# EAGLE design Adafruit SIM808 Breakout (EAGLE 6.6.0)
COMPANY: ADAFRUIT INDUSTRIES; DRAWN: KTOWN; REV: C
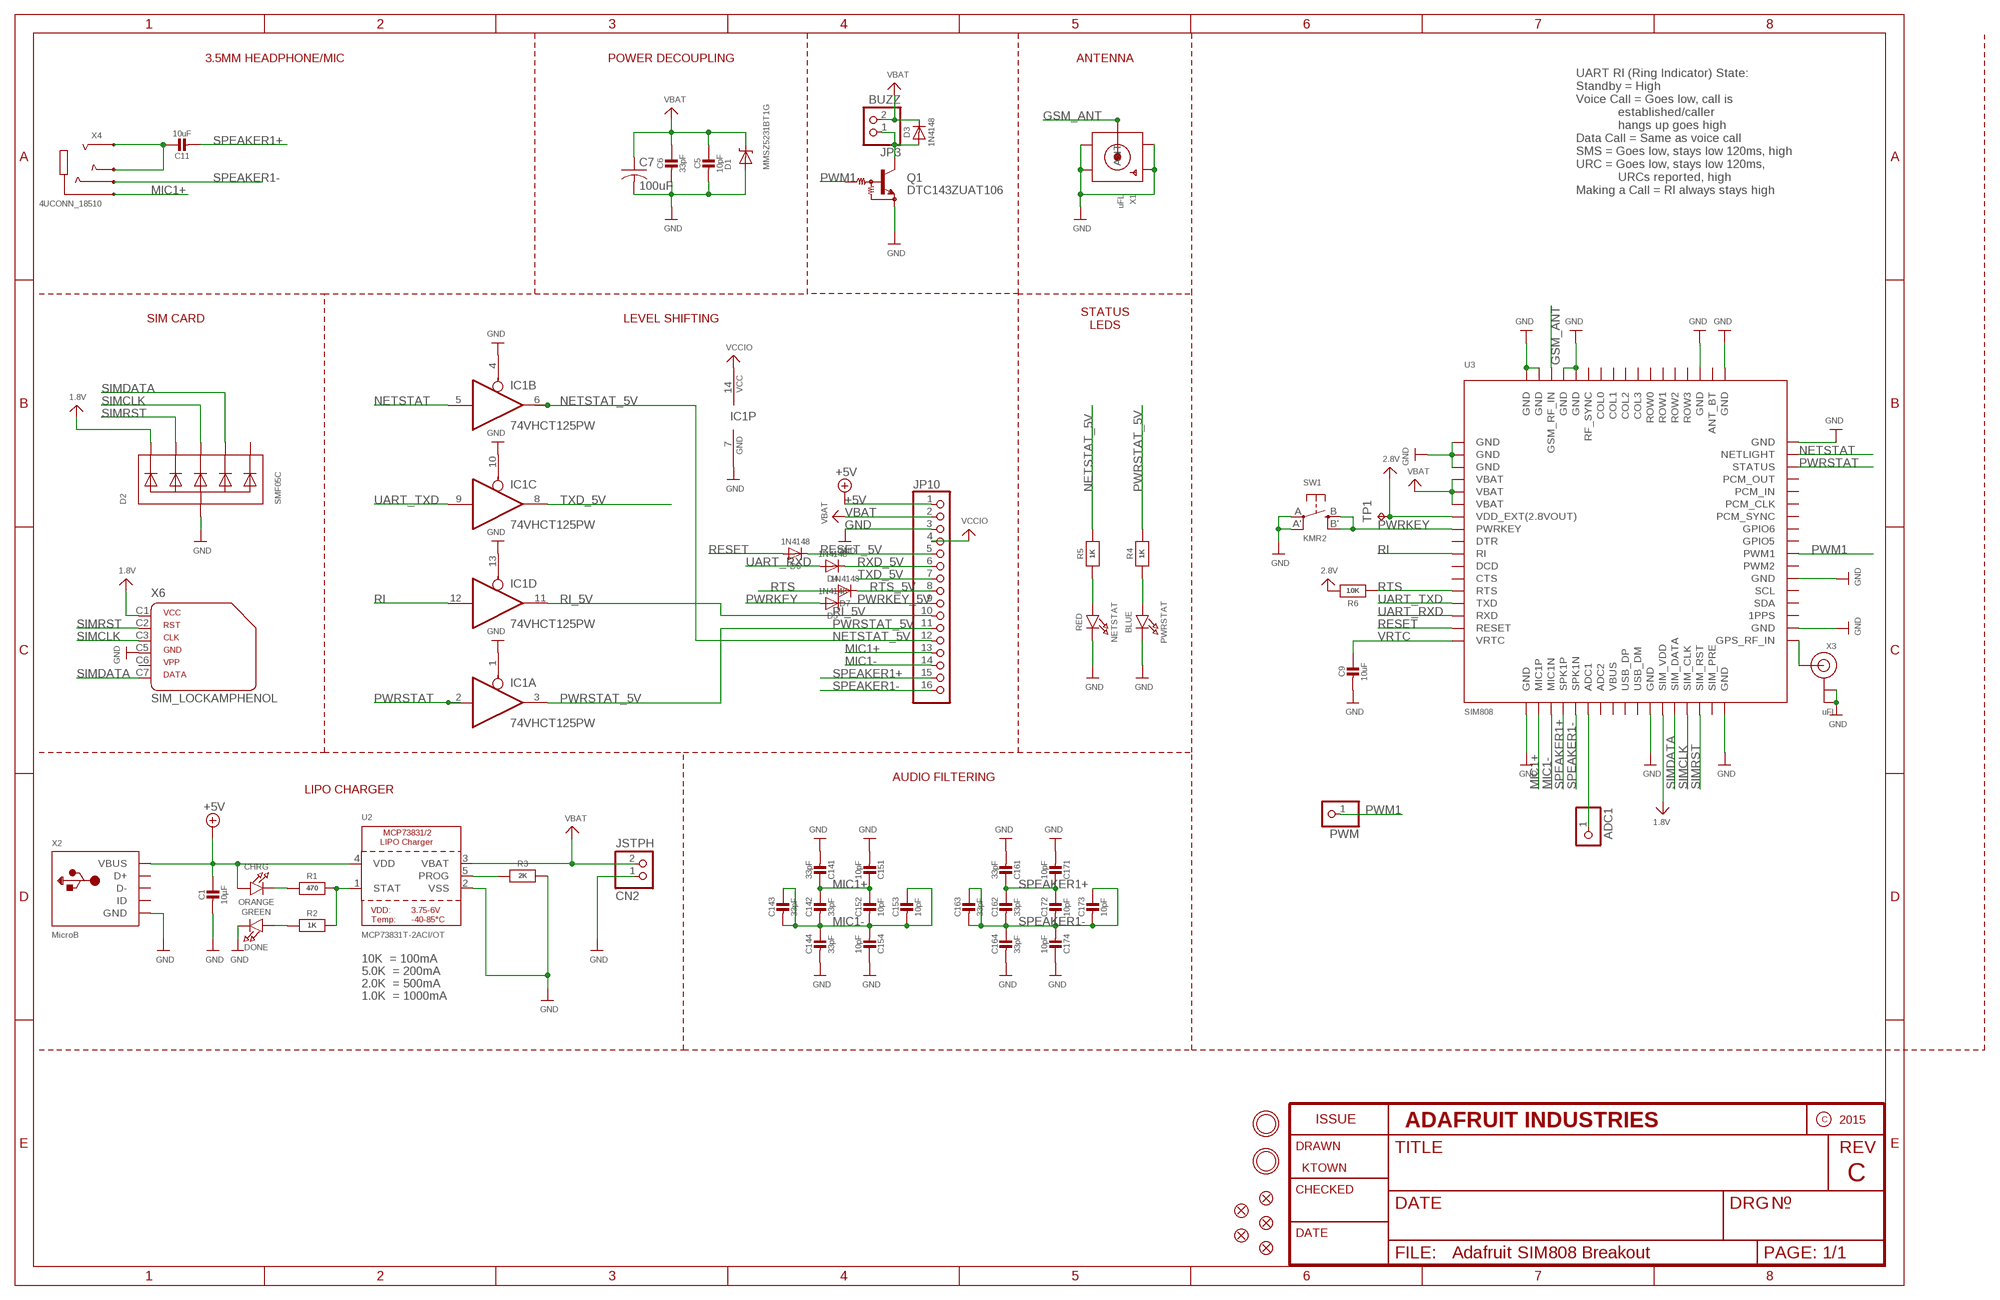
[diagram p0: schematic, sheet 1]

## Parts
ADC1  PINHD-1X1CB  [1X01-CLEANBIG]
C1  10µF  CAP_CERAMIC0805-NOOUTLINE  [0805-NO]
C5  10pF  CAP_CERAMIC0805-NOOUTLINE  [0805-NO]
C6  33pF  CAP_CERAMIC0805-NOOUTLINE  [0805-NO]
C7  100uF  C-USC1210  [C1210]
C9  10uF  CAP_CERAMIC0805-NOOUTLINE  [0805-NO]
C11  10uF  CAP_CERAMIC0805-NOOUTLINE  [0805-NO]
C14  33pF  CAP_4PACK1206  [RESPACK_4X0603]
C15  10pF  CAP_4PACK1206  [RESPACK_4X0603]
C16  33pF  CAP_4PACK1206  [RESPACK_4X0603]
C17  10pF  CAP_4PACK1206  [RESPACK_4X0603]
CHRG  ORANGE  LED0805_NOOUTLINE  [CHIPLED_0805_NOOUTLINE]
CN2  JSTPH  JST_2PIN  [JSTPH2]
D1  MMSZ5231BT1G  DIODE-ZENERSOD123  [SOD-123]
D2  SMF05C  TVSARRAY_5LANE  [SOT363]
D3  1N4148  DIODESOD-323  [SOD-323]
D4  1N4148  DIODESOD-323  [SOD-323]
D5  1N4148  DIODESOD-323  [SOD-323]
D6  1N4148  DIODESOD-323  [SOD-323]
D7  1N4148  DIODESOD-323  [SOD-323]
DONE  GREEN  LED0805_NOOUTLINE  [CHIPLED_0805_NOOUTLINE]
FID1  FIDUCIAL""  [FIDUCIAL_1MM]
FID2  FIDUCIAL""  [FIDUCIAL_1MM]
FID3  FIDUCIAL""  [FIDUCIAL_1MM]
FID4  FIDUCIAL""  [FIDUCIAL_1MM]
FID5  FIDUCIAL""  [FIDUCIAL_1MM]
IC1  74VHCT125PW  74ABT125PW  [TSSOP14]
JP3  BUZZ  HEADER-1X2ROUND  [1X02_ROUND]
JP10  HEADER-1X16ROUND  [1X16_ROUND]
NETSTAT  RED  LED0805_NOOUTLINE  [CHIPLED_0805_NOOUTLINE]
PWM  PINHD-1X1CB  [1X01-CLEANBIG]
PWRSTAT  BLUE  LED0805_NOOUTLINE  [CHIPLED_0805_NOOUTLINE]
Q1  DTC143ZUAT106  MUN2211T1-NPN_DRIVER-SC59-BEC  [SC59-BEC]
R1  470  RESISTOR0805_NOOUTLINE  [0805-NO]
R2  1K  RESISTOR0805_NOOUTLINE  [0805-NO]
R3  2K  RESISTOR0805_NOOUTLINE  [0805-NO]
R4  1K  RESISTOR0805_NOOUTLINE  [0805-NO]
R5  1K  RESISTOR0805_NOOUTLINE  [0805-NO]
R6  10K  RESISTOR0805_NOOUTLINE  [0805-NO]
SW1  KMR2  SWITCH_TACT_SMT4.6X2.8  [BTN_KMR2_4.6X2.8]
TP1  TPTP11R  [TP11R]
U2  MCP73831T-2ACI/OT  MCP73831/2  [SOT23-5]
U3  SIM808  GSM_SIM808_LITERAL  [SIM900_SMT]
U$33  MOUNTINGHOLE2.5  [MOUNTINGHOLE_2.5_PLATED]
U$34  MOUNTINGHOLE2.5  [MOUNTINGHOLE_2.5_PLATED]
X1  uFL  SMACONNECTOR_EDGE_UFL  [SMA_EDGELAUNCH_UFL]
X2  MicroB  USBMICRO_20329  [4UCONN_20329]
X3  uFL  ANTENNA_U.FL  [U.FL]
X4  4UCONN_18510  AUDIO_3.5MMJACK_4POL  [4UCONN_18510]
X6  SIM_LOCKAMPHENOL  [C707_10M006_512_2]

## Nets
1.8V: D2.1(C1) U3.P$29(SIM_VDD) X6.C1
2.8V: R6.2 TP1.TP U3.P$7(VDD_EXT(2.8VOUT))
+5V: C1.1 CHRG.A JP10.1 U2.4(VDD) X2.VBUS
GND: C1.2 C5.2 C6.2 C7.2 C9.2 C14.5 C14.8 C15.4 C15.8 C16.5 C16.8 C17.4 C17.8 CN2.1 D1.A D2.2(A) DONE.C IC1.1(A:OE) IC1.4(B:OE) IC1.7(P:GND) IC1.10(C:OE) IC1.13(D:OE) JP10.3 NETSTAT.C PWRSTAT.C Q1.E R3.2 SW1.A'(P1) SW1.A(P) U2.2(VSS) U3.P$1(GND) U3.P$2(GND) U3.P$3(GND) U3.P$18(GND) U3.P$28(GND) U3.P$34(GND) U3.P$36(GND) U3.P$40(GND) U3.P$51(GND) U3.P$52(GND) U3.P$54(GND) U3.P$64(GND) U3.P$65(GND) U3.P$67(GND) U3.P$68(GND) X1.GND@1(GND1) X1.GND@2(GND2) X1.GND@3(GND3) X1.GND@4(GND4) X2.BASE@1(GND) X2.BASE@2(GND) X2.GND X2.SPRT@1(GND) X2.SPRT@2(GND) X2.SPRT@3(GND) X2.SPRT@4(GND) X3.1(GND) X3.2(GND) X6.C5
GSM_ANT: U3.P$66(GSM_RF_IN) X1.P(ANT)
HP+: C11.1 X4.2-TIP(RING3) X4.3-OUTER_SLEEVE(RING2)
MIC1+: C14.1 C14.2 C15.1 C15.2 JP10.13 U3.P$19(MIC1P) X4.1-GND(TIP)
MIC1-: C14.3 C14.4 C14.6 C14.7 C15.3 C15.5 C15.6 C15.7 JP10.14 U3.P$20(MIC1N)
N$1: CHRG.C R1.1
N$2: R1.2 R2.2 U2.1(STAT)
N$3: U3.P$35(GPS_RF_IN) X3.3(SIGNAL)
N$4: PWRSTAT.A R4.1
N$5: R3.1 U2.5(PROG)
N$6: DONE.A R2.1
N$7: ADC1.1 U3.P$23(ADC1)
N$9: NETSTAT.A R5.1
N$16: D3.A JP3.1 Q1.C
NETSTAT: IC1.5(B:I) U3.P$50(NETLIGHT)
NETSTAT_5V: IC1.6(B:O) JP10.12 R5.2
PWM1: PWM.1 Q1.B U3.P$42(PWM1)
PWRKEY: D5.A SW1.B'(S1) SW1.B(S) U3.P$8(PWRKEY)
PWRKEY_5V: D5.C JP10.9
PWRSTAT: IC1.2(A:I) U3.P$49(STATUS)
PWRSTAT_5V: IC1.3(A:O) JP10.11 R4.2
RESET: D6.A U3.P$16(RESET)
RESET_5V: D6.C JP10.5
RI: IC1.12(D:I) U3.P$10(RI)
RI_5V: IC1.11(D:O) JP10.10
RTS: D7.A R6.1 U3.P$13(RTS)
RTS_5V: D7.C JP10.8
RXD_5V: D4.C JP10.6
SIMCLK: D2.4(C3) U3.P$31(SIM_CLK) X6.C3
SIMDATA: D2.5(C4) U3.P$30(SIM_DATA) X6.C7
SIMRST: D2.3(C2) U3.P$32(SIM_RST) X6.C2
SPEAKER1+: C11.2 C16.1 C16.2 C17.1 C17.2 JP10.15 U3.P$21(SPK1P)
SPEAKER1-: C16.3 C16.4 C16.6 C16.7 C17.3 C17.5 C17.6 C17.7 JP10.16 U3.P$22(SPK1N) X4.4-INNER_SLEEVE(RING1)
TXD_5V: IC1.8(C:O) JP10.7
UART_RXD: D4.A U3.P$15(RXD)
UART_TXD: IC1.9(C:I) U3.P$14(TXD)
VBAT: C5.1 C6.1 C7.1 CN2.2 D1.C D3.C JP3.2 JP10.2 U2.3(VBAT) U3.P$4(VBAT) U3.P$5(VBAT) U3.P$6(VBAT)
VCCIO: IC1.14(P:VCC) JP10.4
VRTC: C9.1 U3.P$17(VRTC)
Unconnected: D2.6(C5) U3.P$9(DTR) U3.P$11(DCD) U3.P$12(CTS) U3.P$24(ADC2) U3.P$26(USB_DP) U3.P$27(USB_DM) U3.P$33(SIM_PRE) U3.P$37(1PPS) U3.P$38(SDA) U3.P$39(SCL) U3.P$41(PWM2) U3.P$43(GPIO5) U3.P$44(GPIO6) U3.P$45(PCM_SYNC) U3.P$46(PCM_CLK) U3.P$47(PCM_IN) U3.P$48(PCM_OUT) U3.P$53(ANT_BT) U3.P$55(ROW3) U3.P$56(ROW2) U3.P$57(ROW1) U3.P$58(ROW0) U3.P$59(COL3) U3.P$60(COL2) U3.P$61(COL1) U3.P$62(COL0) U3.P$63(RF_SYNC) X2.D+ X2.D- X2.ID X6.C6

## Notes on the sheet
- 3.5MM HEADPHONE/MIC | POWER DECOUPLING | ANTENNA
- UART RI (Ring Indicator) State:
  Standby = High
  Voice Call = Goes low, call is 
              established/caller 
              hangs up goes high
  Data Call = Same as voice call
  SMS = Goes low, stays low 120ms, high
  URC = Goes low, stays low 120ms,
              URCs reported, high
  Making a Call = RI always stays high
- SIM CARD | LEVEL SHIFTING
- STATUS
  LEDS
- AUDIO FILTERING
- LIPO CHARGER
- 10K  = 100mA
- 5.0K  = 200mA
- 2.0K  = 500mA
- 1.0K  = 1000mA

## Power pins joined to a net without a drawn wire
VBUS: U3.P$25(VBUS)

## Library data of the parts
ADC1 PWM = adafruit:PINHD-1X1: Pin header 1x1 for 0.1" spacing With round pins
C1 C5 C6 C9 C11 = microbuilder:CAP_CERAMIC: Ceramic Capacitors For new designs, use the packages preceded by an '_' character since they are more reliable: The following footprints should be used on most boards: _0402 - Standard footprint for regular board layouts _0603 - Standard footprint for regular board layouts _0805 - Standard footprint for regular board layouts _1206 - Standard footprint for regular board layouts For extremely tight-pitch boards where space is at a premium, the following 'micro-pitch' footprints can be used (smaller pads, no silkscreen outline, etc.): _0402MP - Micro-pitch footprint for very dense/compact boards _0603MP - Micro-pitch footprint for very dense/compact boards _0805MP - Micro-pitch footprint for very dense/compact boards _1206MP - Micro-pitch footprint for very dense/compact boards
C7 = rcl:C-US: CAPACITOR, American symbol
C14-C17 = microbuilder:CAP_4PACK
CHRG DONE NETSTAT PWRSTAT = microbuilder:LED: LED 0603 - 0603 Surface Mount Package 2mA: Green LED - Low Power (3.9mcd, 2ma, 1.7Vf) - Digikey: 475-2709-2-ND Orange LED - Low Power (9.8mcd, 2ma, 1.8Vf) - Digikey: 475-1194-2-ND Red LED - Low Power (5mcd, 2ma, 1.8Vf) - Digikey: 475-1195-2-ND Yellow LED - Low Power (7mcd, 2ma, 1.8Vf) - Digikey: 475-1196-2-ND 5mA: Blue LED - Low Power (17mcd, 5ma, 2.9Vf) - Digikey: LNJ937W8CRACT-ND 0805 - 0805 Surface Mount Package 2mA: Red LED (8.8mcd, 2mA, 1.8Vf, Clear) - Low Power [Digikey: 475-2510-1-ND] Green LED (5mcd, 2mA, 1.8Vf, Clear) - Low Power [Digikey: 475-2730-1-ND] Yellow LED (11.3mcd, 2mA, 1.8Vf, Clear) - Low Power [Digikey: 475-2555-1-ND] 20mA: Red LED (104mcd, 20mA, Diffused) - LS R976 [Digikey: 475-1278-6-ND] Red LED (12mcd, 20mA, 2.0Vf, Clear) - APT2012EC [Digikey: 754-1128-1-ND] Green LED (15mcd, 20mA, 2.2Vf, Clear) - APT2012GC [Digikey: 754-1131-1-ND] Orange LED (160mcd, 20mA, 2.1Vf, Clear) - APT2012SECK [Digikey: 754-1130-1-ND] 1206 - 1206 Surface Mount Package Green LED (26mcd, 20mA, Diffused) - LG N971 [Digikey: 475-1407-6-ND] Red LED (15mcd, 20mA, Diffused) - LH N974 [Digikey: 475-1416-6-ND] Cree - Cree High-Power Surface Mount LEDs XPEBWT-L1-0000-00D50 - White 111lm 350mA 2.9Vf 6200K 110° XTEAWT-00-0000-00000LEE3 - White 114lm 350mA 2.85Vf 5000K 115° Everlight - Everlight 45-21 Series Surface Mount LEDs 45-21/QK2C-B2832AC2CB2/2T - Warm White 2000mcd 20mA 3.25Vf 3050K 120° 45-21/LK2C-B38452C4CB2/2T - Nuetral White 2000mcd 20mA 3.25Vf 4150K 120° 45-21/LK2C-B50634C6CB2/2T - Cold White 2200mcd 20mA 3.25Vf 5650K 120° PLCC2 Reverse Mount LS T77K-J1L2-1-0-2-R18-Z - Red 11.25mcd 2mA 1.8Vf 630nm 120° LO T77K-L1M2-24-Z - Orange 19.6mcd 2mA 1.8Vf 606nm 120° LY T77K-K2M1-26-Z - Yellow 15.7mcd 2mA 1.8Vf 587nm 120°
CN2 = microbuilder:JST_2PIN: JST 2-Pin Right-Angle Connector PH-Series - 4UConnector: 17311 SH-Series - 4UConnector: 07278
D1 = microbuilder:DIODE-ZENER: Zener Diode SMA: 30V 1W Zener Diode, 1.2Vf - Digikey: SMAZ30-FDICT-ND
D2 = microbuilder:TVSARRAY_5LANE: Voltage Transient Suppressor Array SOT363 SMF05C - 100W 5V: Digikey - SMF05CT1GOSCT-ND
D3-D7 = microbuilder:DIODE: Diode SMA Model Volts Amps Type Vf Ir Digikey # Notes SSA34-E3 40V 3A Schottky 480mV @ 3A 200uA @ 40V SSA34-E3/61TGITR-ND CDBA120-G 20V 1A Schottky 500mV @ 1A 500uA @ 20V 641-1014-6-ND REEL MBRA210 10V 2A Schottky 350mV @ 2A 700uA @ 10V MBRA210LT3 SOD-123 Model Volts Amps Type Vf Ir Order # Notes BAT54T1G 30V 200mA Schottky 800mV @ 200mA 2uA @ 25V BAT54T1GOSTR-ND B0530W 30V 500mA Schottky 430mV @ 500mA 130uA @ 30V B0530W-FDICT-ND REEL MBR120 20V 1A Schottky 340mV @ 1A MBR120VLSFT1GOSCT-ND SOD-323 Model Volts Amps Type Vf Ir Order # Notes PMEG2005EJ 20V 500mA Schottky 355mV @ 500mA 568-4110-1-ND ZLLS410 10V 570mA Schottky 380mV @ 570mA ZLLS410CT-ND 1N4148WS 75V 150mA Silicon/Simple 1V 1N4148WSFSCT-ND REEL SOD-523 Model Volts Amps Type Vf Ir Order # Notes BAT54XV2 30V 200mA Schottky 0.8V @ 100mA BAT54XV2CT-ND TB751S 30V 30mA Schottky RB751S-40TE61CT-ND SOT23-R/W (R = Solder Paste/Reflow Ovens, W = Hand-Soldering) Model Volts Amps Type Vf Ir Order # Notes BAT54FILM 40V 300mA Schottky 497-7162-1-ND POWERDI-5 Model Volts Amps Type Vf Ir Order # Notes PDS560 60V 5A Schottky 670mV @ 5A 150uA @ 60V PDS560DICT-ND
FID1-FID5 = microbuilder:FIDUCIAL: Fiducial Alignment Points Various fiducial points for machine vision alignment.; BOM: EXCLUDE
IC1 = 74xx-us:74*125: Quad bus BUFFER, 3-state
JP3 = microbuilder:HEADER-1X2: PIN HEADER
JP10 = microbuilder:HEADER-1X16: PIN HEADER
Q1 = transistor:*-NPN_DRIVER-: NPN Bias Resistor Transistor
R1-R6 = microbuilder:RESISTOR: Resistors For new designs, use the packages preceded by an '_' character since they are more reliable: The following footprints should be used on most boards: _0402 - Standard footprint for regular board layouts _0603 - Standard footprint for regular board layouts _0805 - Standard footprint for regular board layouts _1206 - Standard footprint for regular board layouts For extremely tight-pitch boards where space is at a premium, the following 'micro-pitch' footprints can be used (smaller pads, no silkscreen outline, etc.): _0402MP - Micro-pitch footprint for very dense/compact boards _0603MP - Micro-pitch footprint for very dense/compact boards _0805MP - Micro-pitch footprint for very dense/compact boards _1206MP - Micro-pitch footprint for very dense/compact boards
SW1 = microbuilder:SWITCH_TACT_SMT: SMT Tact Switches 6x6mm - Digikey: P12940SCT-ND KMR2 (4.6x2.8mm) - Digikey: 401-1426-1-ND EVQ-PQHB55 - Light Touch, 160GF (4.5x4.5mm) - Digikey: P8090SCT-ND KMT0 - KMT021 NGJ LHS (etc.) IP68/Waterproof - Digikey: CKN10289CT-ND
TP1 = testpad:TP: Test pad
U2 = microbuilder:MCP73831/2: MCP73831/2 LIPO Charger VDD: 3.75 - 6V Temp -40 - 85°C Programmable Charge Rate: 15-500mA NOTE: STAT is a tri-state logic output on the MCP73831 and an open-drain output on the MCP73832. SOT23-5 with 4.2V output and tri-state logic on STAT = MCP73831T-2ACI/OT
U3 = microbuilder:GSM_SIM808_LITERAL: SIM808 GSM Module
U$33 U$34 = microbuilder:MOUNTINGHOLE: Mounting Hole For #2 screws (0.086"/2.18mm width, 0.094"/2.4mm hole) use 2.5mm; BOM: EXCLUDE
X1 = microbuilder:SMACONNECTOR: SMA Connector 90° DIP SMA Connector, 50 Ohm (4UConnector: 07259)
X2 = microbuilder:USB: USB Connectors USBMINIB - Surface Mount Female Mini-B USB Connector 4UConnector: 06564
X3 = microbuilder:ANTENNA_U.FL: U.FL Antenna Connector
X4 = microbuilder:AUDIO_3.5MMJACK_4POL: Footprint courtesy Morten Hjerde (Riftlabs.com) These are normally connected as follows (4-pin 3.5mm 'TRRS'), from left-to right on the schematic symbol above: Tip: Left Audio Outermost Ring: Right Audio Innermost Ring: Common/GND Shell: Mic+
X6 = microbuilder:SIM_LOCK: C707A SIMLOCK® 2.5 mm with wide solder tails Source: Data sheet <http://www.amphenol.info/downloads/C707_10M006_512_2.pdf>; OC_FARNELL: unknown; OC_NEWARK: unknown

## Board
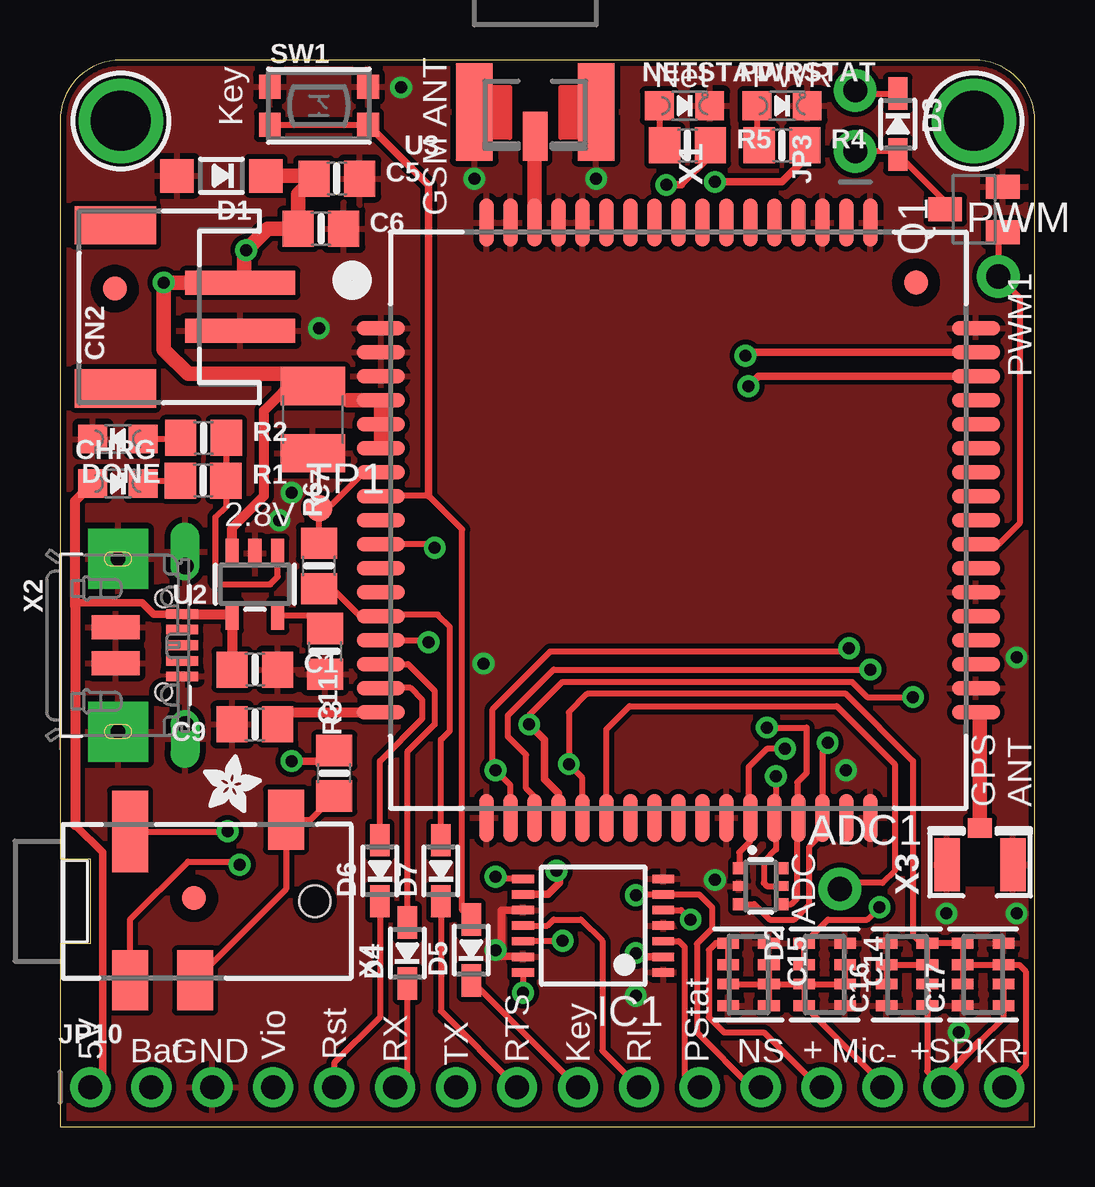
[diagram p1: board, top side]
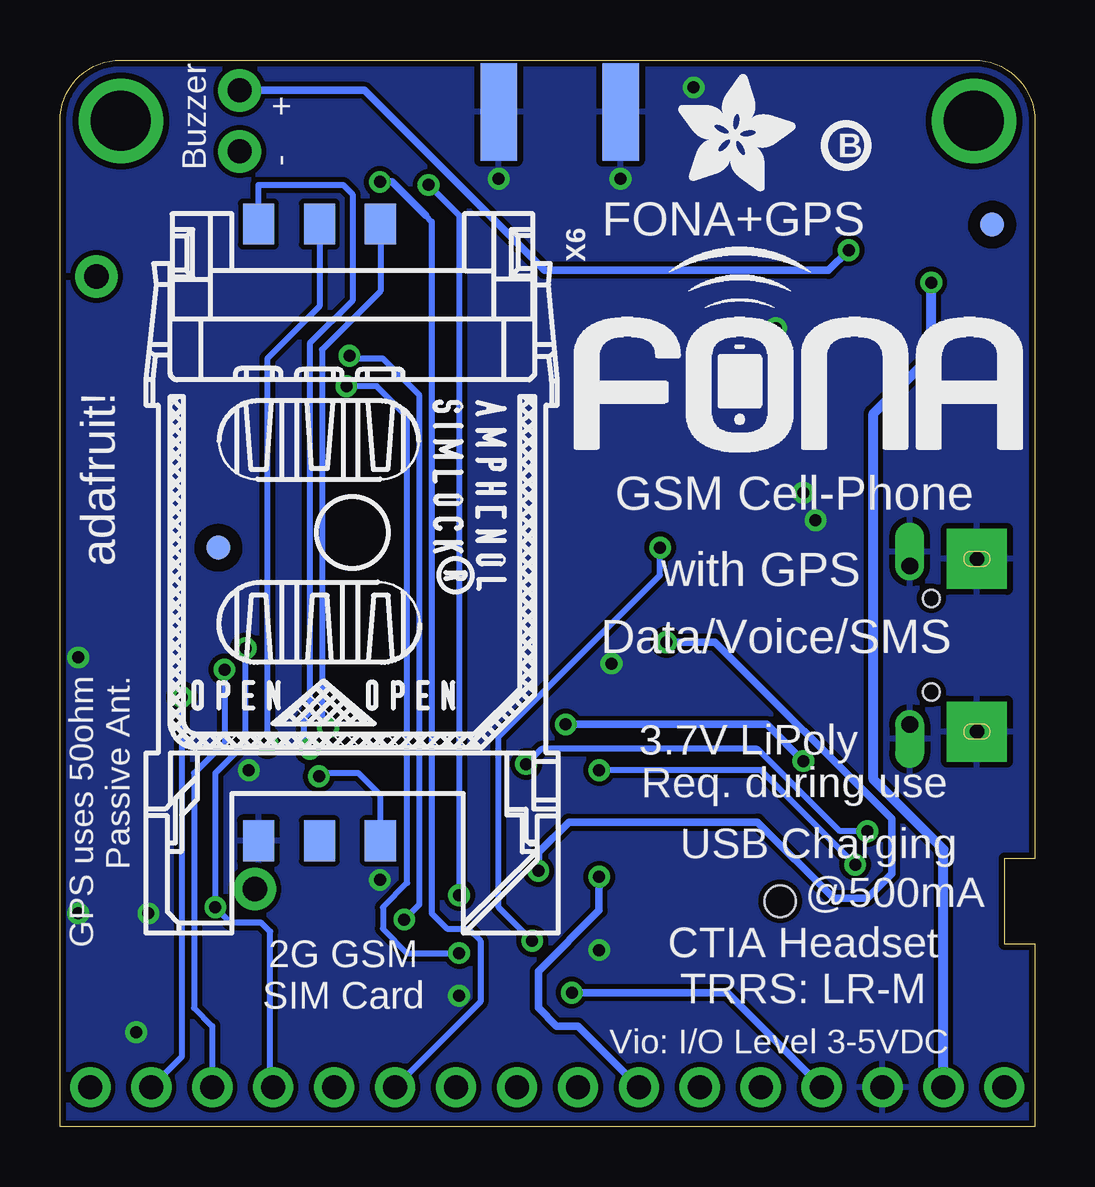
[diagram p2: board, bottom side, seen from below]

Size 40.64 x 44.45 mm. Coordinates in mm from the lower left corner, seen from the top.
Outline: 0,0 40.64,0 40.64,41.91 arc90 38.1,44.45 2.54,44.45 arc90 0,41.91 0,11.18 1.27,11.18 1.27,7.62 0,7.62 0,0
Copper layers (1*16): Top 0.035mm / dielectric 1.5mm / Bottom 0.035mm
Design rules "adafruit *": minimum track width 8mil, minimum drill 15.5mil, track to track 8mil, track to pad 8mil, pad to pad 8mil, via to via 8mil, smd to smd 8mil, copper to edge 10mil, drill to drill 8mil, minimum pad ring 10mil, minimum via ring 8mil, stop-mask expansion 2mil, vias tented up to drill 20mil, thermal gap 10mil

### Footprints (pad centres in the part's own frame; a part is rotated, then mirrored left to right if it is on the bottom)
1X01-CLEANBIG = drill 1.016 pad 1.778: 1 0,0
0805-NO = smd 1.3 x 1.5: 1 -0.95,0; 2 0.95,0
C1210 = smd 1.6 x 2.7: 1 -1.4,0; 2 1.4,0
RESPACK_4X0603 = smd 0.45 x 0.9: 1 -1.3,-0.85; 2 -0.4,-0.85; 3 0.4,-0.85; 4 1.3,-0.85; 5 1.3,0.85; 6 0.4,0.85; 7 -0.4,0.85; 8 -1.3,0.85
CHIPLED_0805_NOOUTLINE = smd 1.2 x 1.2: A 0,-1.05; C 0,1.05
JSTPH2 = smd 1 x 4.6: 1 -1,-3.7; 2 1,-3.7 | smd 1.6 x 3.4: NC1 -3.4,1.5; NC2 3.4,1.5
SOD-123 = smd 1.4 x 1.4: A 1.85,0; C -1.85,0
SOT363 = smd 0.5 x 0.5: 1 -0.75,-0.9; 3 0.75,-0.9; 4 0.75,0.9; 6 -0.75,0.9 | smd 0.4 x 0.5: 2 0,-0.9; 5 0,0.9
SOD-323 = smd 1.35 x 0.8: A 1.27,0; C -1.27,0
FIDUCIAL_1MM = smd 1 x 1: 1 0,0
TSSOP14 = smd 0.35 x 0.9: 1 -1.95,-2.925; 2 -1.3,-2.925; 3 -0.65,-2.925; 4 0,-2.925; 5 0.65,-2.925; 6 1.3,-2.925; 7 1.95,-2.925; 8 1.95,2.925; 9 1.3,2.925; 10 0.65,2.925; 11 0,2.925; 12 -0.65,2.925; 13 -1.3,2.925; 14 -1.95,2.925
1X02_ROUND = drill 1 pad 1.778: 1 -1.27,0; 2 1.27,0
1X16_ROUND = drill 1 pad 1.676: 1 -19.05,0; 2 -16.51,0; 3 -13.97,0; 4 -11.43,0; 5 -8.89,0; 6 -6.35,0; 7 -3.81,0; 8 -1.27,0; 9 1.27,0; 10 3.81,0; 11 6.35,0; 12 8.89,0; 13 11.43,0; 14 13.97,0; 15 16.51,0; 16 19.05,0
SC59-BEC = smd 1 x 1.4: B -0.95,-1.2; C 0,1.2; E 0.95,-1.2
BTN_KMR2_4.6X2.8 = smd 0.9 x 1: A 2.05,0.8; A' -2.05,0.8; B 2.05,-0.8; B' -2.05,-0.8
TP11R = smd 1.1 x 1.1: TP 0,0
SOT23-5 = smd 0.55 x 1.2: 1 -0.95,-1.3; 2 0,-1.3; 3 0.95,-1.3; 4 0.95,1.3; 5 -0.95,1.3
SIM900_SMT = smd 2 x 0.6: P$1 -12.4,8; P$2 -12.4,7; P$3 -12.4,6; P$4 -12.4,5; P$5 -12.4,4; P$6 -12.4,3; P$7 -12.4,2; P$8 -12.4,1; P$9 -12.4,0; P$10 -12.4,-1; P$11 -12.4,-2; P$12 -12.4,-3; P$13 -12.4,-4; P$14 -12.4,-5; P$15 -12.4,-6; P$16 -12.4,-7; P$17 -12.4,-8; P$35 12.4,-8; P$36 12.4,-7; P$37 12.4,-6; P$38 12.4,-5; P$39 12.4,-4; P$40 12.4,-3; P$41 12.4,-2; P$42 12.4,-1; P$43 12.4,0; P$44 12.4,1; P$45 12.4,2; P$46 12.4,3; P$47 12.4,4; P$48 12.4,5; P$49 12.4,6; P$50 12.4,7; P$51 12.4,8 | smd 0.6 x 2: P$18 -8,-12.4; P$19 -7,-12.4; P$20 -6,-12.4; P$21 -5,-12.4; P$22 -4,-12.4; P$23 -3,-12.4; P$24 -2,-12.4; P$25 -1,-12.4; P$26 0,-12.4; P$27 1,-12.4; P$28 2,-12.4; P$29 3,-12.4; P$30 4,-12.4; P$31 5,-12.4; P$32 6,-12.4; P$33 7,-12.4; P$34 8,-12.4; P$52 8,12.4; P$53 7,12.4; P$54 6,12.4; P$55 5,12.4; P$56 4,12.4; P$57 3,12.4; P$58 2,12.4; P$59 1,12.4; P$60 0,12.4; P$61 -1,12.4; P$62 -2,12.4; P$63 -3,12.4; P$64 -4,12.4; P$65 -5,12.4; P$66 -6,12.4; P$67 -7,12.4; P$68 -8,12.4
MOUNTINGHOLE_2.5_PLATED = drill 2.5 pad 3.2: P$1 0,0
SMA_EDGELAUNCH_UFL = smd 4.064 x 1.524: GND@1 2.032,-2.54; GND@2 2.032,2.54 | smd 4.064 x 1.524 bottom: GND@3 2.032,2.54; GND@4 2.032,-2.54 | smd 2.032 x 1.016: P 3.048,0
4UCONN_20329 = smd 1 x 2: BASE@1 -0.75,-2; BASE@2 0.75,-2 | smd 0.4 x 1.35: D+ 0,0.775; D- -0.65,0.775; GND 1.3,0.775; ID 0.65,0.775; VBUS -1.3,0.775 | drill 0.7 offset: SPRT@1 -3.3,0.9; SPRT@2 3.3,0.9 | drill 0.6 pad 2.5 square: SPRT@3 -3.6,-1.9; SPRT@4 3.6,-1.9 | hole 0.7: -1.95,0; 1.95,0
U.FL = smd 2.2 x 1.05: 1 0,1.375; 2 0,-1.375 | smd 0.8 x 1: 3 1.525,0
4UCONN_18510 = smd 1.5 x 2.5: 1-GND 2.8,-3.3; 2-TIP 9.3,3.4; 3-OUTER_SLEEVE 5.5,-3.3 | smd 1.5 x 3.4: 4-INNER_SLEEVE 2.8,2.9 | hole 1.3: 10.5,0
C707_10M006_512_2 = smd 1.7 x 1.3: C1 -12.85,-3.915; C2 -12.85,-1.375; C3 -12.85,1.165; C5 12.85,-3.915; C6 12.85,-1.375; C7 12.85,1.165

### Placement (x,y rotation side)
ADC1  32.51,9.91 0 top
C1  8.13,19.05 0 top
C5  11.54,39.51 0 top
C6  10.88,37.42 0 top
C7  10.54,29.46 270 top
C9  8.13,16.76 180 top
C11  11.43,14.73 90 top
C14  31.88,6.35 270 top
C15  28.7,6.35 270 top
C16  35.31,6.35 90 top
C17  38.48,6.35 90 top
CHRG  2.41,26.81 270 top
CN2  3.81,34.16 90 top
D1  6.73,39.62 180 top
D2  29.21,10.03 270 top
D3  34.92,41.78 270 top
D4  14.48,7.24 90 top
D5  17.14,7.37 90 top
D6  13.34,10.67 90 top
D7  15.88,10.67 90 top
DONE  2.42,28.66 90 top
FID1  35.69,35.18 0 top
FID2  2.29,34.92 0 top
FID3  5.59,9.53 0 top
FID4  1.78,37.59 0 bottom
FID5  34.04,24.13 0 bottom
IC1  22.23,8.38 90 top
JP3  33.15,41.91 90 top
JP10  20.32,1.65 0 top
NETSTAT  26.04,42.55 270 top
PWM  39.12,35.43 0 top
PWRSTAT  30.1,42.55 270 top
Q1  38.1,38.23 90 top
R1  5.97,26.92 0 top
R2  5.99,28.7 0 top
R3  11.05,19.81 270 top
R4  30.1,40.89 0 top
R5  26.16,40.89 0 top
R6  10.79,23.37 90 top
SW1  10.79,42.55 0 top
TP1  10.79,25.78 0 top
U2  8.13,22.61 180 top
U3  25.78,25.27 0 top
U$21  [ADAFRUIT_2.5MM]  5.97,13.08 0 top
U$25  [PCBFEAT-REV-040]  7.87,40.89 0 bottom
U$26  [FONA_LOGO]  19.68,27.94 0 bottom
U$33  38.1,41.91 90 top
U$34  2.54,41.91 90 top
U$36  [ADAFRUIT_5MM]  14.86,38.99 0 bottom
X1  19.81,44.32 270 top
X2  4.32,20.07 270 top
X3  38.35,10.92 90 top
X4  0.13,9.4 0 top
X6  28.45,24.77 270 bottom

### Tracks (layer width: path | path; a pad name or v marks a point on that pad's centre or on a via)
1.8V  (via drill 0.5)
  Top 0.254: v30.23,15.75 29.46,15.75 28.7,14.99 28.7,12.95 U3.P$29 28.78,11.89 28.32,11.43 28.32,10.79 D2.1
  Bottom 0.254: X6.C1 32.36,39.24 28.83,39.24 28.45,38.86 28.45,34.42 30.23,32.64 30.23,17.27 30.48,17.02 30.48,16 v30.23,15.75
2.8V
  Top 0.254: R6.2 TP1.TP 10.92,25.91 11.3,25.91 12.67,27.27
  Top 0.305: U3.P$7 12.67,27.27
+5V
  Top 0.305: X2.VBUS 3.91,21.37 3.43,21.84 0.76,21.84 0.64,21.72 | 0.64,12.57 1.78,11.43 1.78,2.16 JP10.1
  Top 0.406: C1.1 U2.4 7.12,21.37 X2.VBUS | CHRG.A 0.64,26.08 0.64,21.72 0.64,12.57
GND  (via drill 0.5)
  Top 0.305: IC1.10 18.41,9.03 18.41,7.11 19.43,7.11
  other vias: 10.79,33.27 9.65,26.42 14.22,43.31 17.27,39.5 22.35,39.5 9.14,25.27 36.96,8.89 39.88,8.89 37.47,3.94 27.3,10.29 17.65,19.3 18.16,7.37 24,5.46 39.88,19.56 32.77,14.86
  pour Top: 0,44.2 -0.13,-0.13 40.64,0 40.77,44.32
  pour Bottom: 0,44.32 0,-0.13 40.77,0 40.77,44.45
GSM_ANT
  Top 0.61: U3.P$66 19.78,41.27 X1.P
HP+
  Top 0.254: X4.3-OUTER_SLEEVE 9.43,9.9 X4.2-TIP 10.45,12.8 C11.1
MIC1+  (via drill 0.5)
  Top 0.254: C15.2 C15.1 27.34,7.65 27.05,7.37 27.05,4.57 27.69,3.94 29.34,3.94 31.75,1.52 JP10.13 | C14.2 C14.1 32.01,8.64 33.66,8.64 v34.16,9.14 | X4.1-GND 2.93,8.64 5.33,11.05 7.37,11.05 v7.49,10.92 | v32.89,19.94 32.89,19.81 20.45,19.81 18.03,17.4 18.03,14.99 v18.16,14.86 18.78,14.24 U3.P$19
  Bottom 0.254: JP10.13 31.88,1.78 31.88,8.13 32.26,8.51 33.53,8.51 v34.16,9.14 34.16,14.73 32.89,16 v32.89,19.94 | v7.49,10.92 11.43,14.86 v18.16,14.86
MIC1-  (via drill 0.5)
  Top 0.254: C15.7 C15.6 | C15.6 C15.5 | C15.3 C15.6 | C15.6 C14.3 | C14.3 C14.4 34.29,1.79 JP10.14 | C14.3 C14.6 C14.7 | U3.P$20 19.78,13.75 19.43,14.1 19.43,15.49 18.67,16.26 18.67,17.14 20.57,19.05 v33.78,19.05
  Bottom 0.254: v33.78,19.05 33.78,16 35.05,14.73 35.05,4.95 34.29,4.19 JP10.14
N$1
  Top 0.254: CHRG.C 3.58,26.92 R1.1
N$2
  Top 0.254: R2.2 6.92,28.69 R1.2 6.92,25.84 6.48,25.4 6.48,22.73 6.6,22.61 8.76,22.61 9.08,22.92 U2.1
N$3
  Top 0.61: X3.3 38.35,17.27 U3.P$35
N$4
  Top 0.254: PWRSTAT.A 29.05,40.99 R4.1
N$5
  Top 0.254: U2.5 10.57,21.31 11.05,20.83 R3.1
N$6
  Top 0.254: R2.1 4.99,28.66 DONE.A
N$7
  Top 0.254: U3.P$23 22.78,16.56 23.75,17.53 32.38,17.53 34.8,15.11 34.8,10.67 34.29,10.16 32.77,10.16 ADC1.1
N$9
  Top 0.254: NETSTAT.A 24.98,41.12 R5.1
N$16
  Top 0.254: JP3.1 34.8,40.64 D3.A 36.9,38.54 Q1.C
NETSTAT  (via drill 0.5)
  Top 0.254: IC1.5 25.89,9.03 v26.29,8.64
  Top 0.305: v28.57,32.13 28.72,32.27 U3.P$50
  Bottom 0.254: v26.29,8.64 25.65,9.27 25.65,30.48 27.18,32 28.45,32 v28.57,32.13
  Bottom 0.305: 28.57,32 v28.57,32.13
NETSTAT_5V  (via drill 0.5)
  Top 0.254: v24,9.65 24.03,9.68 IC1.6 26.64,9.68 27.18,9.14 27.18,8.26 26.54,7.62 26.54,3.94 28.83,1.65 JP10.12 | 25.91,39.24 27.11,40.45 R5.2
  Top 0.305: v25.27,39.24 25.91,39.24 | 27.11,40.57 R5.2
  Bottom 0.254: v24,9.65 24,37.97 v25.27,39.24
PWM1
  Top 0.254: Q1.B 39.12,37.09 PWM.1 40.01,34.54 40.01,25.15 39.13,24.27 U3.P$42
PWRKEY
  Top 0.254: SW1.B' SW1.B | D5.A 16.76,9.02 16.76,24.89 15.37,26.29 13.4,26.29 U3.P$8
  Top 0.305: SW1.B 15.37,39.22 15.37,26.29
PWRKEY_5V
  Top 0.254: D5.C JP10.9
PWRSTAT  (via drill 0.5)
  Top 0.305: U3.P$49 29.11,31.27 v28.7,30.86 | v24,7.24 24.16,7.08 IC1.2
  Bottom 0.254: v24,7.24 26.16,7.24 27.18,8.26 27.18,9.14 26.16,10.16 26.16,29.59 27.43,30.86 v28.7,30.86
PWRSTAT_5V  (via drill 0.5)
  Top 0.254: IC1.3 25.8,7.73 26.04,7.49 26.04,2.16 26.54,1.65 JP10.11 | 31.11,40.39 31.05,40.45 R4.2
  Top 0.305: R4.2 31.05,40.57 | 31.11,40.39 30.1,39.37 v27.3,39.37
  Bottom 0.254: 26.54,1.65 JP10.11 23.11,5.21 23.11,7.75 23.62,8.26 24.51,8.26 25.15,8.89 25.15,37.72 25.4,37.97
  Bottom 0.305: v27.3,39.37 26.8,39.37 25.4,37.97
RESET
  Top 0.254: D6.A 13.34,15.24 15.11,17.02 15.11,17.78 14.61,18.29 13.4,18.29 U3.P$16
RESET_5V
  Top 0.254: D6.C 13.34,4.57 11.43,2.67 JP10.5
RI  (via drill 0.5)
  Top 0.254: v15.62,24.13 15.48,24.27 U3.P$10 | v20.95,7.75 20.94,7.73 IC1.12
  Bottom 0.254: v15.62,24.13 15.62,22.99 22.35,16.26 22.35,9.14 v20.95,7.75
RI_5V
  Top 0.254: IC1.11 20.32,8.38 20.57,8.64 21.72,8.64 22.61,7.75 22.61,3.17 JP10.10
RTS
  Top 0.254: D7.A 15.88,16.13 16.26,16.51 16.26,20.83 15.75,21.34 13.44,21.34 U3.P$13 13.32,21.34 12.45,21.34 11.36,22.42 R6.1
RTS_5V
  Top 0.254: D7.C 15.88,4.83 JP10.8
RXD_5V
  Top 0.254: D4.C 14.48,2.16 JP10.6
SIMCLK  (via drill 0.5)
  Top 0.254: 30.72,12.81 U3.P$31 | v29.46,16.64 31.11,16.64 31.11,14.73 30.73,14.35 30.73,12.92 U3.P$31 | D2.4 30.49,9.28 30.73,9.53 30.73,12.83 U3.P$31
  Bottom 0.254: X6.C3 27.28,34.82 29.72,32.38 29.72,16.89 v29.46,16.64
SIMDATA  (via drill 0.5)
  Top 0.254: v29.84,14.61 29.84,12.94 U3.P$30 29.84,12.81 29.84,11.56 29.34,11.05 29.34,10.16 29.46,10.03 D2.5
  Bottom 0.254: X6.C7 27.28,13.82 28.19,14.73 29.72,14.73 v29.84,14.61
SIMRST  (via drill 0.5)
  Top 0.254: 31.88,12.78 U3.P$32 | v32,16 31.78,15.78 U3.P$32 | D2.3 28.94,9.28 29.59,8.64 30.61,8.64 31.24,9.27 31.24,11.68 31.78,12.22 U3.P$32
  Bottom 0.254: X6.C2 29.82,34.19 32,32 v32,16
SPEAKER1+  (via drill 0.5)
  Top 0.254: C17.1 C17.2 39.33,4.53 38.35,3.56 | C16.2 C16.1 36.16,2.33 JP10.15 | v35.56,17.91 33.66,17.91 33.02,18.54 20.95,18.54 19.56,17.14 v19.56,16.76
  Top 0.305: 38.35,3.56 36.83,2.03 JP10.15 | U3.P$21 20.78,13.89 20.19,14.48 20.19,16.13 v19.56,16.76 | v9.65,15.24 10.99,15.24 C11.2
  Bottom 0.254: v35.56,17.91 35.56,2.92 JP10.15
  Bottom 0.305: v19.56,16.76 11.18,16.76 v9.65,15.24
SPEAKER1-  (via drill 0.5)
  Top 0.254: C16.7 C16.6 C16.3 C16.4 | C16.4 C17.5 C17.6 | C17.6 C17.7 | C17.6 C17.3 39.99,6.75 40.26,6.48 40.26,2.54 JP10.16 | C16.4 35.91,7.65 35.56,8 35.56,15.24 32.77,18.03 21.97,18.03 21.21,17.27 v21.21,15.11 21.78,14.54 U3.P$22 | X4.4-INNER_SLEEVE 6.96,12.3 v6.99,12.32
  Bottom 0.254: v6.99,12.32 8.13,12.32 11.56,15.75 20.57,15.75 v21.21,15.11
TXD_5V  (via drill 0.5)
  Top 0.254: IC1.8 18.24,10.33 v18.16,10.41
  Bottom 0.305: JP10.7 19.05,4.19 19.94,4.19 20.7,4.95 20.7,6.48 18.16,9.02 v18.16,10.41
UART_RXD
  Top 0.254: U3.P$15 14.51,19.27 15.62,18.16 15.62,16.76 14.48,15.62 D4.A
UART_TXD  (via drill 0.5)
  Top 0.254: 13.8,20.27 15.29,20.27 v15.37,20.19
  Top 0.305: IC1.9 20.35,9.68 20.83,10.16 20.83,10.67 v20.7,10.67 | 13.8,20.27 U3.P$14
  Bottom 0.305: v20.7,10.67 20.7,11.43 19.43,12.7 11.56,12.7 8.38,9.53 6.99,9.53 5.97,10.54 5.97,12.83 13.34,20.19 v15.37,20.19
VBAT  (via drill 0.5)
  Top 0.254: JP3.2 33.27,43.05 D3.C | 11.98,30.27 11.13,30.27 C7.1 10.66,30.74 10.66,30.61
  Top 0.406: U2.3 7.18,24.96 8.51,26.29 8.51,29.84 9.27,30.61 10.66,30.61
  Top 0.61: D1.C 10.48,39.62 C5.1 9.93,38.85 C6.1 8.65,37.42 v7.76,36.52 7.67,36.43 7.67,35.16 CN2.2 4.33,35.16 v4.32,35.18 4.32,32.38 5.33,31.37 10.04,31.37 C7.1 | 11.98,30.27 U3.P$4 U3.P$5 U3.P$6
  Bottom 0.305: v7.76,36.52 8.6,35.69 20.45,35.69 27.94,43.18 JP3.2
  Bottom 0.406: JP10.2 3.81,11.56 6.73,14.48 6.73,29.72 4.32,32.13 v4.32,35.18
VCCIO  (via drill 0.5)
  Top 0.254: IC1.14 v19.3,5.59
  Bottom 0.305: JP10.4 12.83,5.59 v19.3,5.59
VRTC
  Top 0.406: C9.1 9.59,17.27 U3.P$17

### Text on the board
tPlace: Key | Net | PWR | GSM ANT | PWM1 | 2.8V | GPS / ANT | ADC | Bat | GND | NS | Mic | 5V | Vio | Rst | RX | TX | RTS | Key | RI | PStat | + | - | + | SPKR | -
bPlace: Buzzer | + | - | FONA+GPS | GSM Cell-Phone | with GPS | adafruit! | Data/Voice/SMS | GPS uses 50ohm / Passive Ant. | 3.7V LiPoly | Req. during use | USB Charging | @500mA | CTIA Headset / TRRS: LR-M | 2G GSM / SIM Card | Vio: I/O Level 3-5VDC